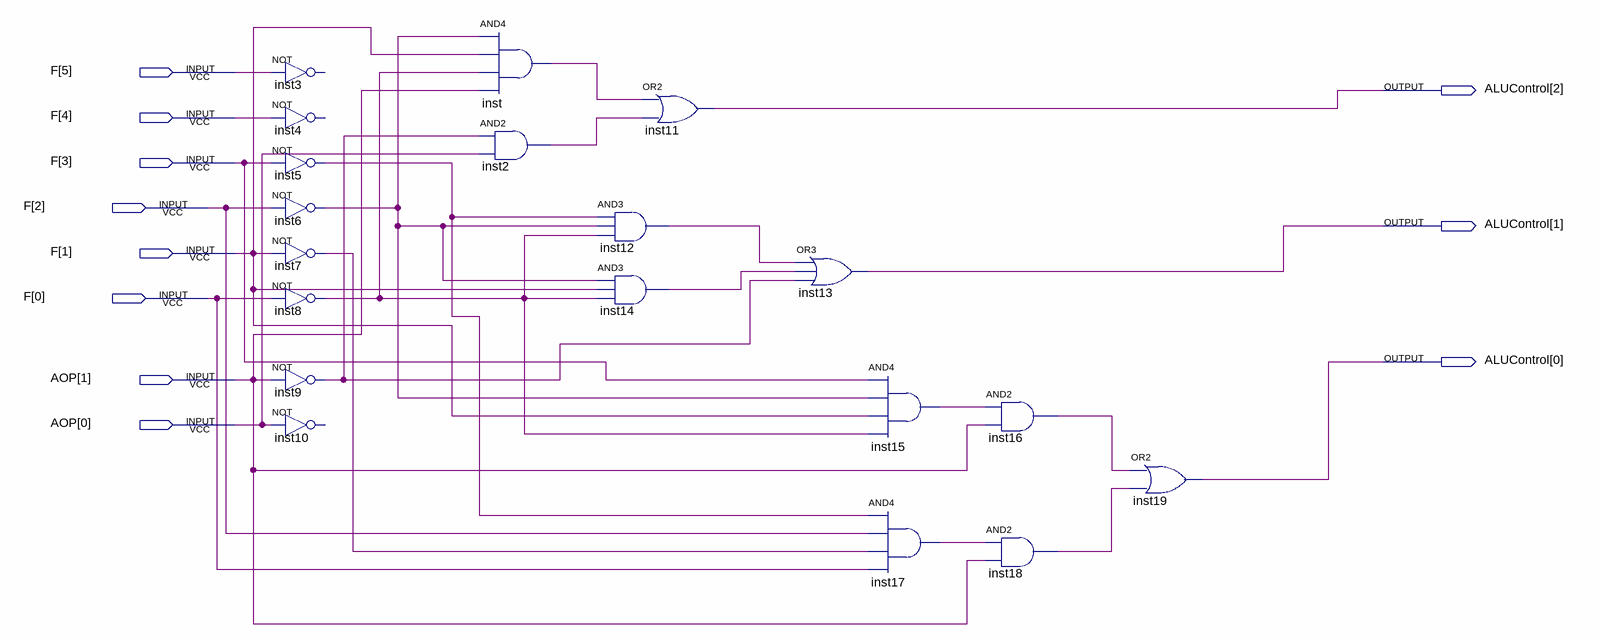
[diagram p0: schematic sheet]
// Quartus schematic ALUDecoder.bdf as structural Verilog: 19 symbols, 11 pins
module ALUDecoder (
  input  [5:0] F,
  input  [1:0] AOP,
  output [2:0] ALUControl
);

  wire inst2_out, inst5_out, inst6_out, inst7_out, inst8_out, inst9_out, inst12_out, inst14_out, inst15_out,
       inst16_out, inst17_out, inst18_out, inst_out;

  // NOT inst3 has open pins: IN=F[5], OUT=open
  // NOT inst4 has open pins: IN=F[4], OUT=open
  not inst5 (inst5_out, F[3]);
  not inst6 (inst6_out, F[2]);
  not inst7 (inst7_out, F[1]);
  not inst8 (inst8_out, F[0]);
  not inst9 (inst9_out, AOP[1]);
  // NOT inst10 has open pins: IN=AOP[0], OUT=open
  and inst (inst_out, inst6_out, F[1], inst8_out, AOP[1]);
  and inst2 (inst2_out, inst9_out, AOP[0]);
  and inst12 (inst12_out, inst5_out, inst6_out, inst8_out);
  and inst14 (inst14_out, inst6_out, F[1], inst8_out);
  or inst11 (ALUControl[2], inst_out, inst2_out);
  or inst13 (ALUControl[1], inst12_out, inst14_out, inst9_out);
  and inst15 (inst15_out, F[3], inst6_out, F[1], inst8_out);
  and inst17 (inst17_out, inst5_out, F[2], inst7_out, F[0]);
  and inst16 (inst16_out, inst15_out, AOP[1]);
  and inst18 (inst18_out, inst17_out, AOP[1]);
  or inst19 (ALUControl[0], inst16_out, inst18_out);
endmodule
